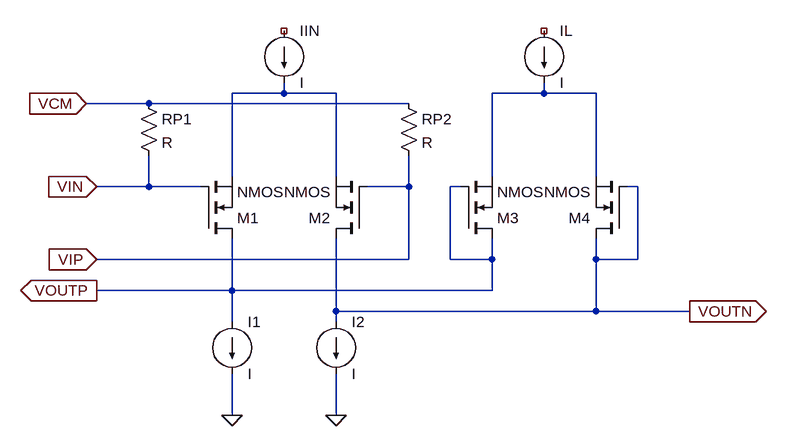
[diagram p0: schematic TGC core circuit.asc]
TGC core circuit.asc, the LTspice schematic file:
Version 4
SHEET 1 956 680
WIRE 208 96 208 80
WIRE 208 96 128 96
WIRE 288 96 208 96
WIRE 608 96 608 80
WIRE 608 96 528 96
WIRE 688 96 608 96
WIRE 0 112 -96 112
WIRE 400 112 0 112
WIRE 128 224 128 96
WIRE 288 224 288 96
WIRE 528 224 528 96
WIRE 688 224 688 96
WIRE 0 240 0 192
WIRE 0 240 -80 240
WIRE 80 240 0 240
WIRE 400 240 400 192
WIRE 400 240 336 240
WIRE 480 240 464 240
WIRE 752 240 736 240
WIRE 400 352 400 240
WIRE 400 352 -80 352
WIRE 464 352 464 240
WIRE 528 352 528 320
WIRE 528 352 464 352
WIRE 688 352 688 320
WIRE 752 352 752 240
WIRE 752 352 688 352
WIRE 128 400 128 320
WIRE 128 400 -80 400
WIRE 528 400 528 352
WIRE 528 400 128 400
WIRE 288 432 288 320
WIRE 688 432 688 352
WIRE 688 432 288 432
WIRE 832 432 688 432
WIRE 128 448 128 400
WIRE 288 448 288 432
WIRE 128 592 128 528
WIRE 288 592 288 528
FLAG 128 592 0
FLAG 288 592 0
FLAG -80 240 VIN
IOPIN -80 240 In
FLAG -80 352 VIP
IOPIN -80 352 In
FLAG -80 400 VOUTP
IOPIN -80 400 Out
FLAG -96 112 VCM
IOPIN -96 112 In
FLAG 832 432 VOUTN
IOPIN 832 432 Out
SYMBOL nmos 80 320 M180
SYMATTR InstName M1
SYMBOL nmos 336 320 R180
SYMATTR InstName M2
SYMBOL current 128 448 R0
SYMATTR InstName I1
SYMBOL current 288 448 R0
SYMATTR InstName I2
SYMBOL current 208 0 R0
SYMATTR InstName IIN
SYMBOL current 608 0 R0
SYMATTR InstName IL
SYMBOL Res -16 96 R0
SYMATTR InstName RP1
SYMBOL Res 384 96 R0
SYMATTR InstName RP2
SYMBOL nmos 480 320 M180
SYMATTR InstName M3
SYMBOL nmos 736 320 R180
SYMATTR InstName M4

The netlist it stands for:
* TGC core circuit.asc
M1 VOUTP VIN N001 N001 NMOS
M2 VOUTN VIP N001 N001 NMOS
I1 VOUTP 0 I
I2 VOUTN 0 I
IIN NC_01 N001 I
IL NC_02 N002 I
RP1 VCM VIN R
RP2 VCM VIP R
M3 VOUTP VOUTP N002 N002 NMOS
M4 VOUTN VOUTN N002 N002 NMOS
.model NMOS NMOS
.model PMOS PMOS
.lib standard.mos
.backanno
.end